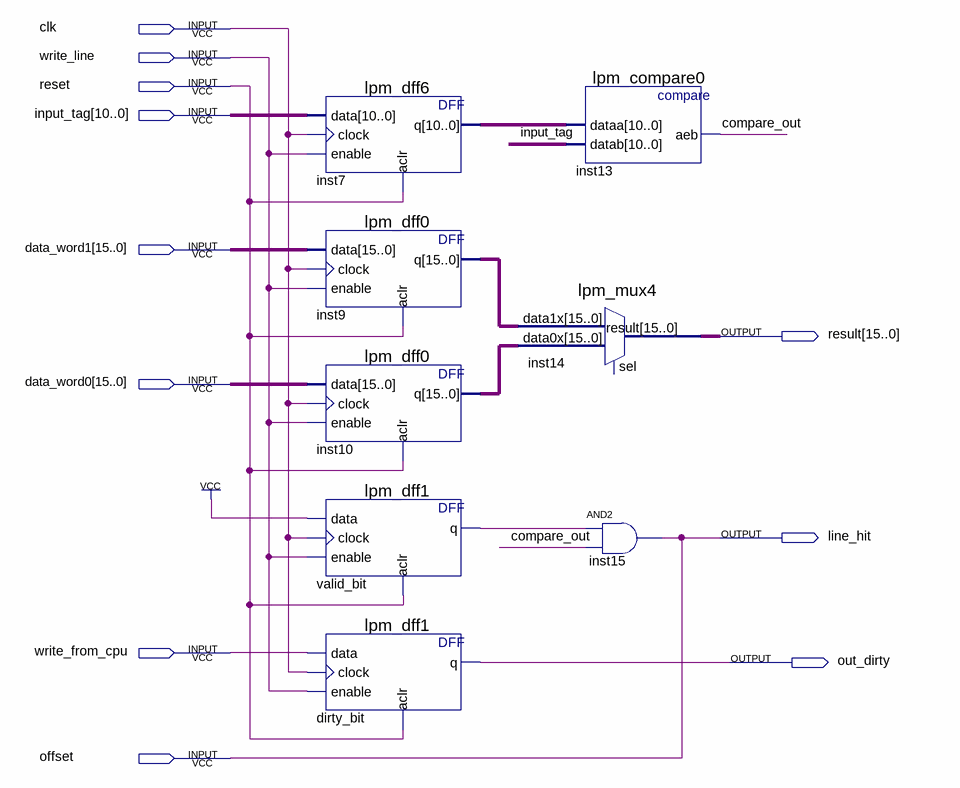
[diagram p0: schematic sheet]
// Quartus schematic cache_line_bank.bdf as structural Verilog: 8 symbols, 11 pins
module cache_line_bank (
  input  clk,
  input  write_line,
  input  reset,
  input  [10:0] input_tag,
  input  [15:0] data_word1,
  input  [15:0] data_word0,
  input  write_from_cpu,
  input  offset,
  output [15:0] result,
  output line_hit,
  output out_dirty
);

  wire compare_out, input_tag_1bit, valid_bit_q;
  wire [10:0] inst7_q;
  wire [15:0] inst9_q, inst10_q;

  lpm_dff6 inst7 (.data(input_tag), .clock(clk), .enable(write_line), .aclr(reset), .q(inst7_q));
  lpm_dff0 inst9 (.data(data_word1), .clock(clk), .enable(write_line), .aclr(reset), .q(inst9_q));
  lpm_dff0 inst10 (.data(data_word0), .clock(clk), .enable(write_line), .aclr(reset), .q(inst10_q));
  lpm_dff1 valid_bit (.data(1'b1), .clock(clk), .enable(write_line), .aclr(reset), .q(valid_bit_q));
  lpm_dff1 dirty_bit (.data(write_from_cpu), .clock(clk), .enable(write_line), .aclr(reset), .q(out_dirty));
  lpm_mux4 inst14 (.data1x(inst9_q), .data0x(inst10_q), .result(result));  // open: sel
  lpm_compare0 inst13 (.dataa(inst7_q), .datab({11{input_tag_1bit}}), .aeb(compare_out));
  and inst15 (offset, valid_bit_q, compare_out);

  assign line_hit = offset;
endmodule
